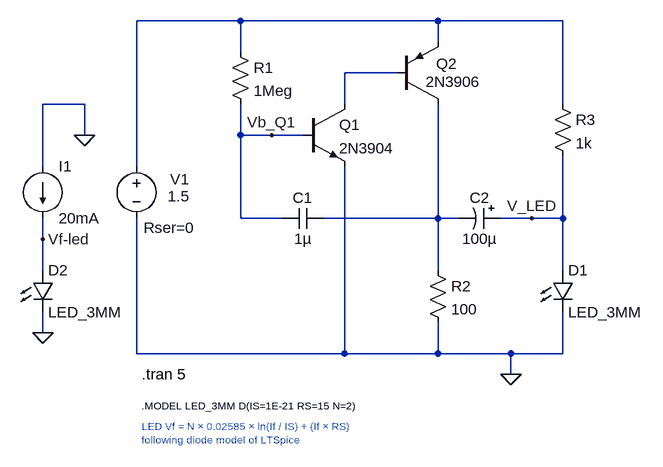
[diagram p0: schematic AA_battery_blinker.asc]
AA_battery_blinker.asc, the LTspice schematic file:
Version 4
SHEET 1 2692 680
WIRE 528 -640 368 -640
WIRE 832 -640 528 -640
WIRE 1024 -640 832 -640
WIRE 832 -608 832 -640
WIRE 528 -592 528 -640
WIRE 768 -560 688 -560
WIRE 288 -512 224 -512
WIRE 688 -512 688 -560
WIRE 1024 -512 1024 -640
WIRE 288 -464 288 -512
WIRE 528 -464 528 -512
WIRE 576 -464 528 -464
WIRE 624 -464 576 -464
WIRE 224 -416 224 -512
WIRE 368 -416 368 -640
WIRE 528 -336 528 -464
WIRE 592 -336 528 -336
WIRE 832 -336 832 -512
WIRE 832 -336 656 -336
WIRE 864 -336 832 -336
WIRE 976 -336 928 -336
WIRE 1024 -336 1024 -432
WIRE 1024 -336 976 -336
WIRE 224 -304 224 -336
WIRE 224 -256 224 -304
WIRE 832 -256 832 -336
WIRE 1024 -256 1024 -336
WIRE 224 -160 224 -192
WIRE 368 -128 368 -336
WIRE 688 -128 688 -416
WIRE 688 -128 368 -128
WIRE 832 -128 832 -176
WIRE 832 -128 688 -128
WIRE 944 -128 832 -128
WIRE 1024 -128 1024 -192
WIRE 1024 -128 944 -128
WIRE 944 -96 944 -128
FLAG 944 -96 0
FLAG 576 -464 Vb_Q1
FLAG 288 -464 0
FLAG 224 -160 0
FLAG 224 -304 Vf-led
FLAG 976 -336 V_LED
SYMBOL voltage 368 -432 R0
WINDOW 3 48 62 Left 2
WINDOW 123 45 92 Left 2
WINDOW 39 11 110 Left 2
WINDOW 0 52 36 Left 2
SYMATTR Value 1.5
SYMATTR SpiceLine Rser=0
SYMATTR InstName V1
SYMBOL npn 624 -512 R0
SYMATTR InstName Q1
SYMATTR Value 2N3904
SYMBOL cap 592 -352 M90
WINDOW 0 0 32 VBottom 2
WINDOW 3 32 32 VTop 2
SYMATTR InstName C1
SYMATTR Value 1µ
SYMATTR SpiceLine Rser=1
SYMBOL pnp 768 -512 M180
WINDOW 0 61 62 Left 2
WINDOW 3 45 34 Left 2
SYMATTR InstName Q2
SYMATTR Value 2N3906
SYMBOL res 512 -608 R0
SYMATTR InstName R1
SYMATTR Value 1Meg
SYMBOL res 816 -272 R0
SYMATTR InstName R2
SYMATTR Value 100
SYMBOL res 1008 -528 R0
SYMATTR InstName R3
SYMATTR Value 1k
SYMBOL LED 1008 -256 R0
SYMATTR InstName D1
SYMATTR Value LED_3MM
SYMBOL polcap 928 -352 R90
WINDOW 0 0 32 VBottom 2
WINDOW 3 32 32 VTop 2
SYMATTR InstName C2
SYMATTR Value 100µ
SYMBOL LED 208 -256 R0
SYMATTR InstName D2
SYMATTR Value LED_3MM
SYMBOL current 224 -416 R0
WINDOW 123 0 0 Left 0
WINDOW 39 0 0 Left 0
SYMATTR InstName I1
SYMATTR Value 20mA
TEXT 376 -96 Left 2 !.tran 5
TEXT 376 -48 Left 1 !.MODEL LED_3MM D(IS=1E-21 RS=15 N=2)
TEXT 376 -16 Left 1 ;LED Vf = N × 0.02585 × ln(If / IS) + (If × RS)\nfollowing diode model of LTSpice

The netlist it stands for:
* AA_battery_blinker.asc
V1 N001 0 1.5 Rser=0
Q1 N002 Vb_Q1 0 0 2N3904
C1 Vb_Q1 N003 1µ Rser=1
Q2 N003 N002 N001 0 2N3906
R1 N001 Vb_Q1 1Meg
R2 N003 0 100
R3 N001 V_LED 1k
D1 V_LED 0 LED_3MM
C2 V_LED N003 100µ
D2 Vf-led 0 LED_3MM
I1 0 Vf-led 20mA
.model D D
.lib standard.dio
.model NPN NPN
.model PNP PNP
.lib standard.bjt
.tran 5
.MODEL LED_3MM D(IS=1E-21 RS=15 N=2)
* LED Vf = N × 0.02585 × ln(If / IS) + (If × RS)
* following diode model of LTSpice
.backanno
.end